# EAGLE design fix (EAGLE 6.6.0)
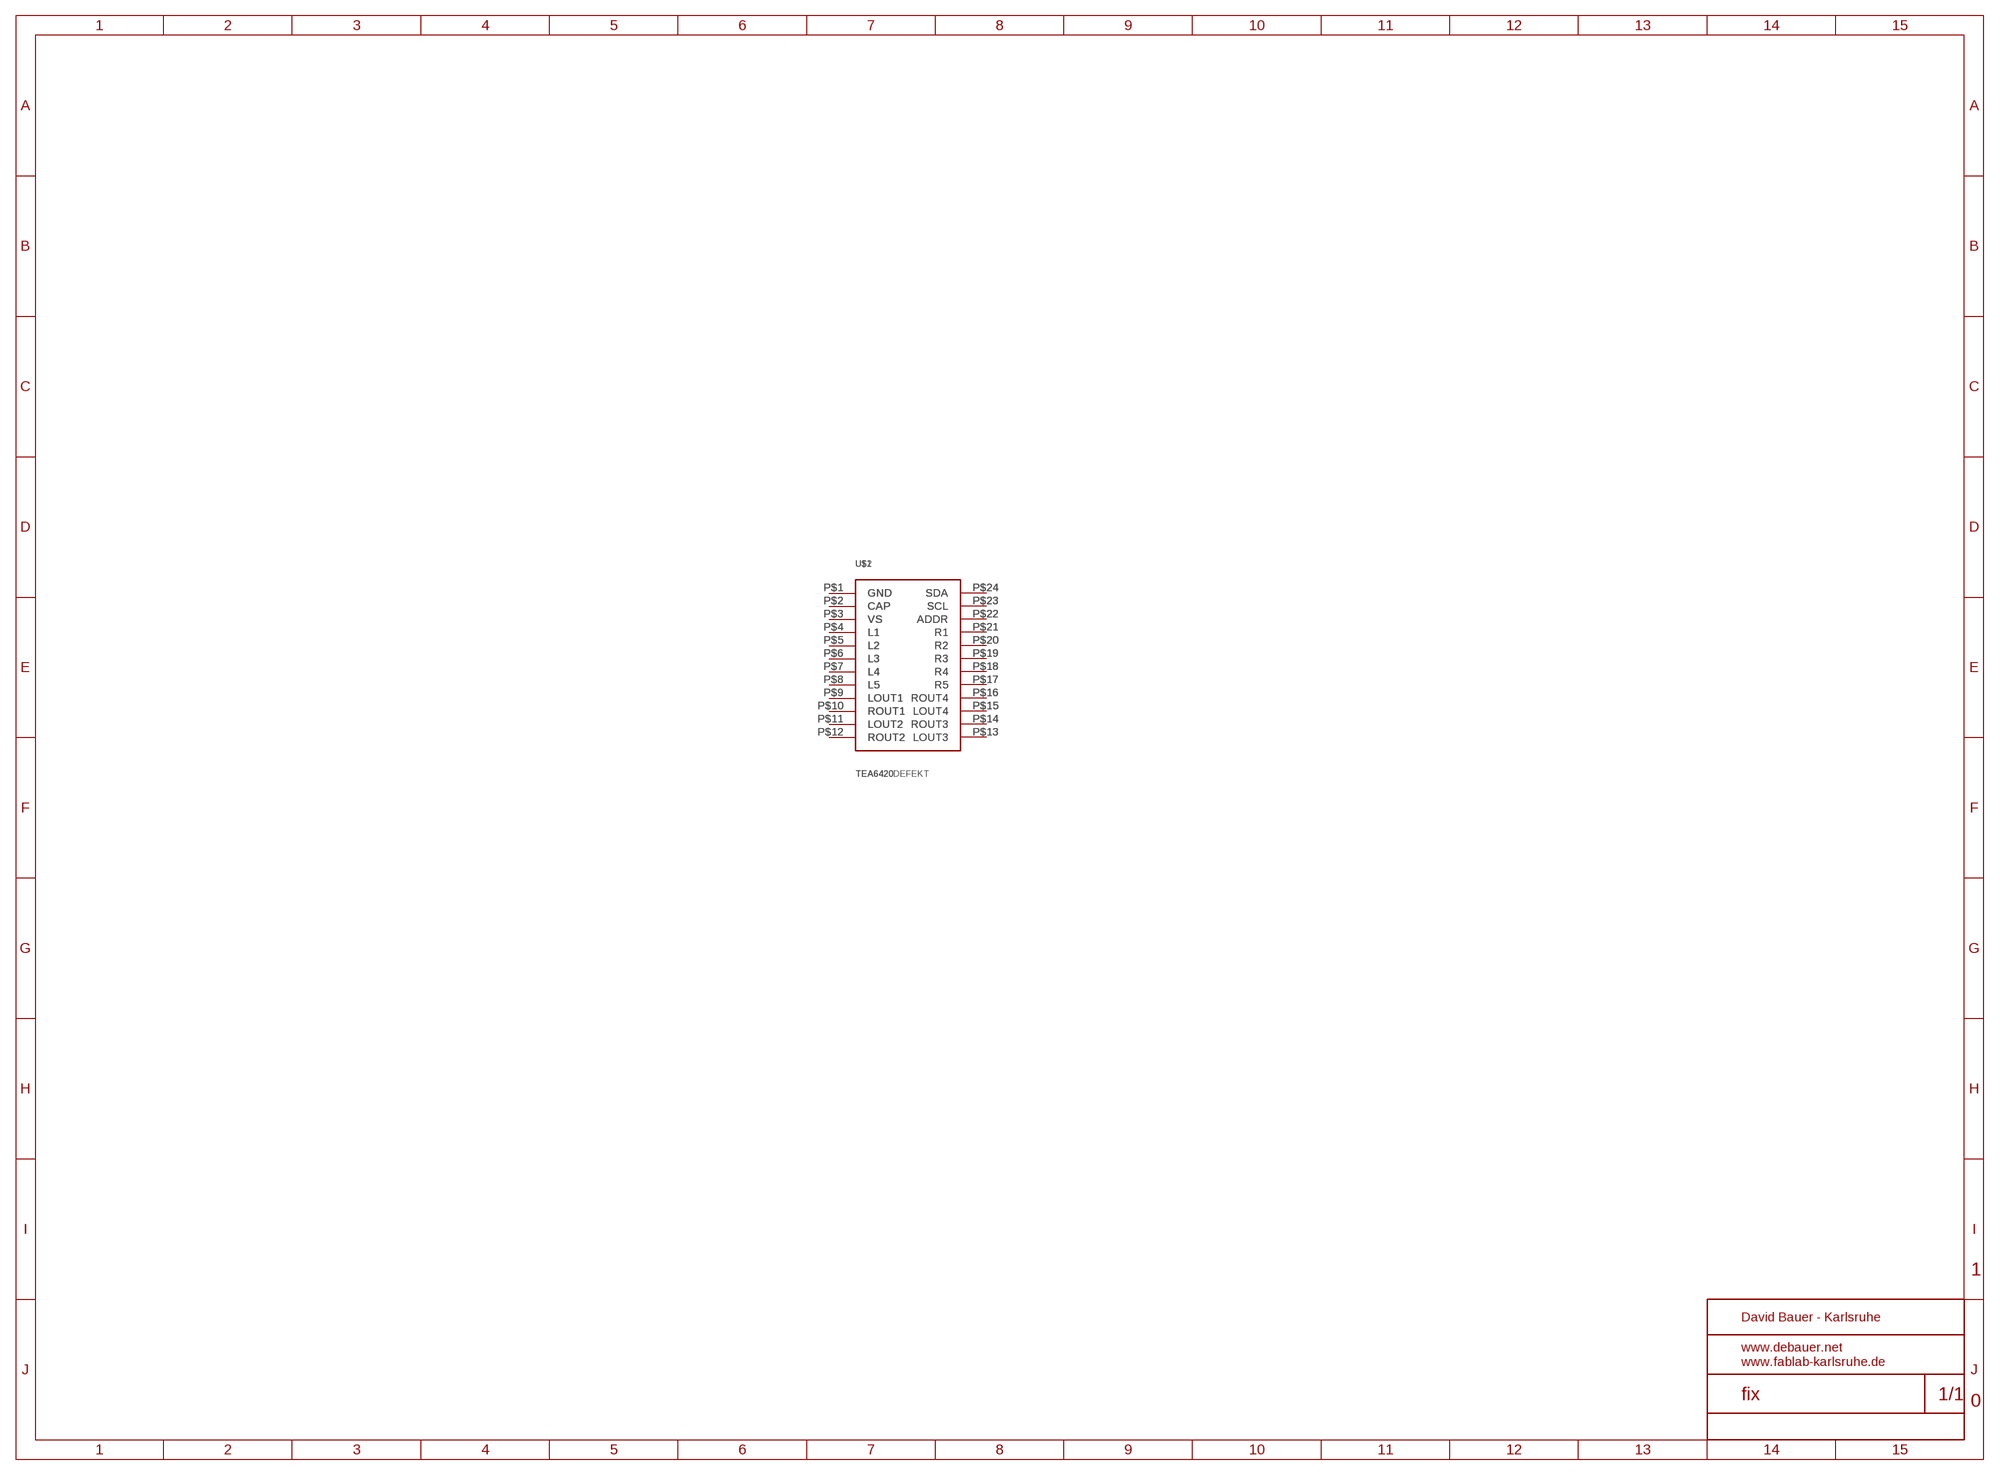
[diagram p0: schematic, sheet 1]

## Parts
U$1  TEA6420  [SHRINK24]
U$2  TEA6420DEFEKT  [TEA4620]

## Nets
N$1: U$1.P$1(GND) U$2.P$1(GND)
N$2: U$1.P$2(CAP) U$2.P$2(CAP)
N$3: U$1.P$3(VS) U$2.P$3(VS)
N$4: U$1.P$4(L1) U$2.P$4(L1)
N$5: U$1.P$5(L2) U$2.P$5(L2)
N$6: U$1.P$6(L3) U$2.P$6(L3)
N$7: U$1.P$7(L4) U$2.P$7(L4)
N$8: U$1.P$8(L5) U$2.P$8(L5)
N$9: U$1.P$9(LOUT1) U$2.P$9(LOUT1)
N$10: U$1.P$10(ROUT1) U$2.P$10(ROUT1)
N$11: U$1.P$11(LOUT2) U$2.P$11(LOUT2)
N$12: U$1.P$12(ROUT2) U$2.P$12(ROUT2)
N$13: U$1.P$13(LOUT3) U$2.P$13(LOUT3)
N$14: U$1.P$14(ROUT3) U$2.P$14(ROUT3)
N$15: U$1.P$15(LOUT4) U$2.P$15(LOUT4)
N$16: U$1.P$16(ROUT4) U$2.P$16(ROUT4)
N$17: U$1.P$17(R5) U$2.P$17(R5)
N$18: U$1.P$18(R4) U$2.P$18(R4)
N$19: U$1.P$19(R3) U$2.P$19(R3)
N$20: U$1.P$20(R2) U$2.P$20(R2)
N$21: U$1.P$21(R1) U$2.P$21(R1)
N$22: U$1.P$22(ADDR) U$2.P$22(ADDR)
N$23: U$1.P$23(SCL) U$2.P$23(SCL)
N$24: U$1.P$24(SDA) U$2.P$24(SDA)

## Library data of the parts
U$1 U$2 = audio:TEA6420

## Board
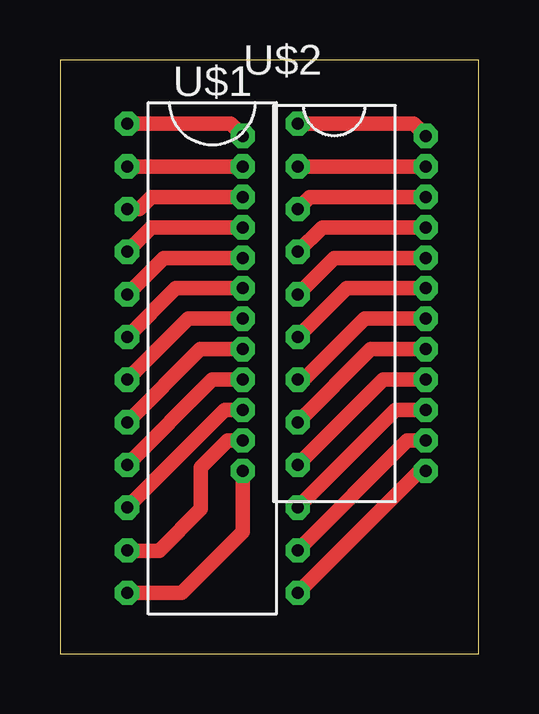
[diagram p1: board, top side]

Size 17.45 x 24.76 mm. Coordinates in mm from the lower left corner, seen from the top.
Outline: 0,0 17.45,0 17.45,24.76 0,24.76 0,0
Copper layers (1+16): Top 0.035mm / dielectric 1.5mm / Bottom 0.035mm
Design rules "ITEADstudio_DRC *": minimum track width 6mil, minimum drill 12mil, track to track 6mil, track to pad 6mil, pad to pad 6mil, via to via 6mil, smd to smd 0mil, copper to edge 10mil, drill to drill 10mil, minimum pad ring 10mil, minimum via ring 6mil, stop-mask expansion 2mil, vias tented up to drill 100mil, thermal gap 10mil

### Footprints (pad centres in the part's own frame; a part is rotated, then mirrored left to right if it is on the bottom)
SHRINK24 = drill 0.5 octagon: P$1 -3.556,10.668; P$2 -3.556,8.89; P$3 -3.556,7.112; P$4 -3.556,5.334; P$5 -3.556,3.556; P$6 -3.556,1.778; P$7 -3.556,0; P$8 -3.556,-1.778; P$9 -3.556,-3.556; P$10 -3.556,-5.334; P$11 -3.556,-7.112; P$12 -3.556,-8.89; P$13 3.556,-8.89; P$14 3.556,-7.112; P$15 3.556,-5.334; P$16 3.556,-3.556; P$17 3.556,-1.778; P$18 3.556,0; P$19 3.556,1.778; P$20 3.556,3.556; P$21 3.556,5.334; P$22 3.556,7.112; P$23 3.556,8.89; P$24 3.556,10.668
TEA4620 = drill 0.5 octagon: P$1 -3.81,6.35; P$2 -3.81,5.08; P$3 -3.81,3.81; P$4 -3.81,2.54; P$5 -3.81,1.27; P$6 -3.81,0; P$7 -3.81,-1.27; P$8 -3.81,-2.54; P$9 -3.81,-3.81; P$10 -3.81,-5.08; P$11 -3.81,-6.35; P$12 -3.81,-7.62; P$13 3.81,-7.62; P$14 3.81,-6.35; P$15 3.81,-5.08; P$16 3.81,-3.81; P$17 3.81,-2.54; P$18 3.81,-1.27; P$19 3.81,0; P$20 3.81,1.27; P$21 3.81,2.54; P$22 3.81,3.81; P$23 3.81,5.08; P$24 3.81,6.35

### Placement (x,y rotation side)
U$1  6.35,11.43 0 top
U$2  11.43,15.24 0 top

### Tracks (layer width: path | path; a pad name or v marks a point on that pad's centre or on a via)
N$1
  Top 0.61: U$1.P$1 7.11,22.1 U$2.P$1
N$2
  Top 0.61: U$1.P$2 U$2.P$2
N$3
  Top 0.61: U$1.P$3 3.3,18.54 3.81,19.05 U$2.P$3
N$4
  Top 0.61: U$1.P$4 3.81,17.78 U$2.P$4
N$5
  Top 0.61: U$2.P$5 4.32,16.51 U$1.P$5
N$6
  Top 0.61: U$2.P$6 4.83,15.24 U$1.P$6
N$7
  Top 0.61: U$2.P$7 5.33,13.97 U$1.P$7
N$8
  Top 0.61: U$2.P$8 5.84,12.7 U$1.P$8
N$9
  Top 0.61: U$2.P$9 6.35,11.43 U$1.P$9
N$10
  Top 0.61: U$2.P$10 6.86,10.16 U$1.P$10
N$11
  Top 0.61: U$2.P$11 6.99,8.89 5.87,7.78 5.87,6.03 4.13,4.29 2.83,4.29 U$1.P$11
N$12
  Top 0.61: U$1.P$12 5.08,2.54 7.62,5.08 U$2.P$12
N$13
  Top 0.61: U$2.P$13 14.99,7.62 U$1.P$13
N$14
  Top 0.61: U$2.P$14 14.48,8.89 U$1.P$14
N$15
  Top 0.61: U$2.P$15 13.97,10.16 U$1.P$15
N$16
  Top 0.61: U$2.P$16 13.46,11.43 U$1.P$16
N$17
  Top 0.61: U$2.P$17 12.95,12.7 U$1.P$17
N$18
  Top 0.61: U$2.P$18 12.7,13.97 10.16,11.43 U$1.P$18
N$19
  Top 0.61: U$2.P$19 11.94,15.24 U$1.P$19
N$20
  Top 0.61: U$2.P$20 11.43,16.51 U$1.P$20
N$21
  Top 0.61: U$2.P$21 10.92,17.78 U$1.P$21
N$22
  Top 0.61: U$2.P$22 10.41,19.05 U$1.P$22
N$23
  Top 0.61: U$1.P$23 U$2.P$23
N$24
  Top 0.61: U$1.P$24 14.73,22.1 U$2.P$24